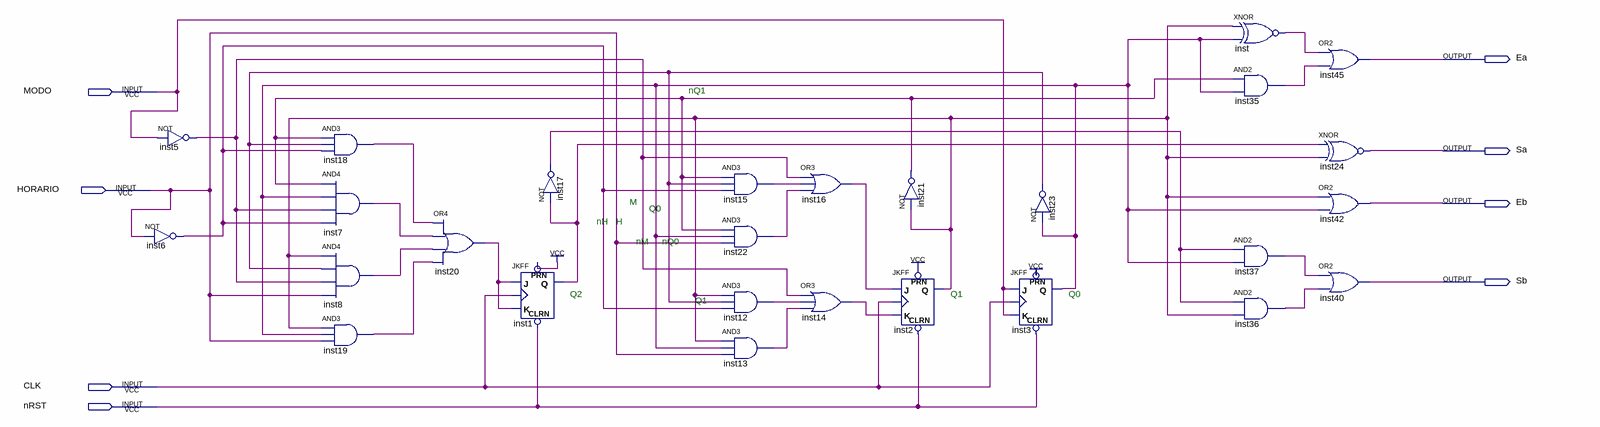
[diagram p0: schematic sheet]
// Quartus schematic CONTROLADOR.bdf as structural Verilog: 27 symbols, 8 pins
module CONTROLADOR (
  input  MODO,
  input  HORARIO,
  input  CLK,
  input  nRST,
  output Ea,
  output Sa,
  output Eb,
  output Sb
);

  wire inst1_q, inst2_q, inst3_q, inst5_out, inst6_out, inst7_out, inst8_out, inst12_out, inst13_out,
       inst14_out, inst15_out, inst16_out, inst17_out, inst18_out, inst19_out, inst20_out, inst21_out,
       inst22_out, inst23_out, inst35_out, inst36_out, inst37_out, inst_out;

  not inst5 (inst5_out, MODO);
  not inst6 (inst6_out, HORARIO);
  and inst18 (inst18_out, inst21_out, inst23_out, inst6_out);
  and inst7 (inst7_out, inst21_out, inst3_q, inst5_out, inst6_out);
  and inst8 (inst8_out, inst2_q, inst23_out, inst5_out, HORARIO);
  and inst19 (inst19_out, inst2_q, inst3_q, HORARIO);
  or inst20 (inst20_out, inst18_out, inst7_out, inst8_out, inst19_out);
  not inst17 (inst17_out, inst1_q);
  JKFF inst1 (.PRN(1'b1), .CLRN(nRST), .K(inst20_out), .J(inst20_out), .CLK(CLK), .Q(inst1_q));
  and inst15 (inst15_out, inst21_out, inst23_out, inst6_out);
  and inst22 (inst22_out, inst21_out, inst3_q, HORARIO);
  and inst12 (inst12_out, inst2_q, inst23_out, inst6_out);
  and inst13 (inst13_out, inst2_q, inst3_q, HORARIO);
  or inst16 (inst16_out, inst5_out, inst15_out, inst22_out);
  or inst14 (inst14_out, inst5_out, inst12_out, inst13_out);
  not inst21 (inst21_out, inst2_q);
  JKFF inst2 (.PRN(1'b1), .CLRN(nRST), .K(inst14_out), .J(inst16_out), .CLK(CLK), .Q(inst2_q));
  JKFF inst3 (.PRN(1'b1), .CLRN(nRST), .K(MODO), .J(MODO), .CLK(CLK), .Q(inst3_q));
  not inst23 (inst23_out, inst3_q);
  xnor inst (inst_out, inst2_q, inst3_q);
  and inst35 (inst35_out, inst21_out, inst3_q);
  and inst37 (inst37_out, inst17_out, inst3_q);
  and inst36 (inst36_out, inst17_out, inst2_q);
  or inst45 (Ea, inst_out, inst35_out);
  xnor inst24 (Sa, inst1_q, inst2_q);
  or inst42 (Eb, inst2_q, inst3_q);
  or inst40 (Sb, inst37_out, inst36_out);

  // Notes on the sheet:
  //   nQ1
  //   M
  //   Q0
  //   nH
  //   H
  //   nM
  //   nQ0
  //   Q2
  //   Q1
  //   Q0
  //   Q1
endmodule
